# Altium project Gyro_Single_Axis.PrjPcb (part 1 of 2)
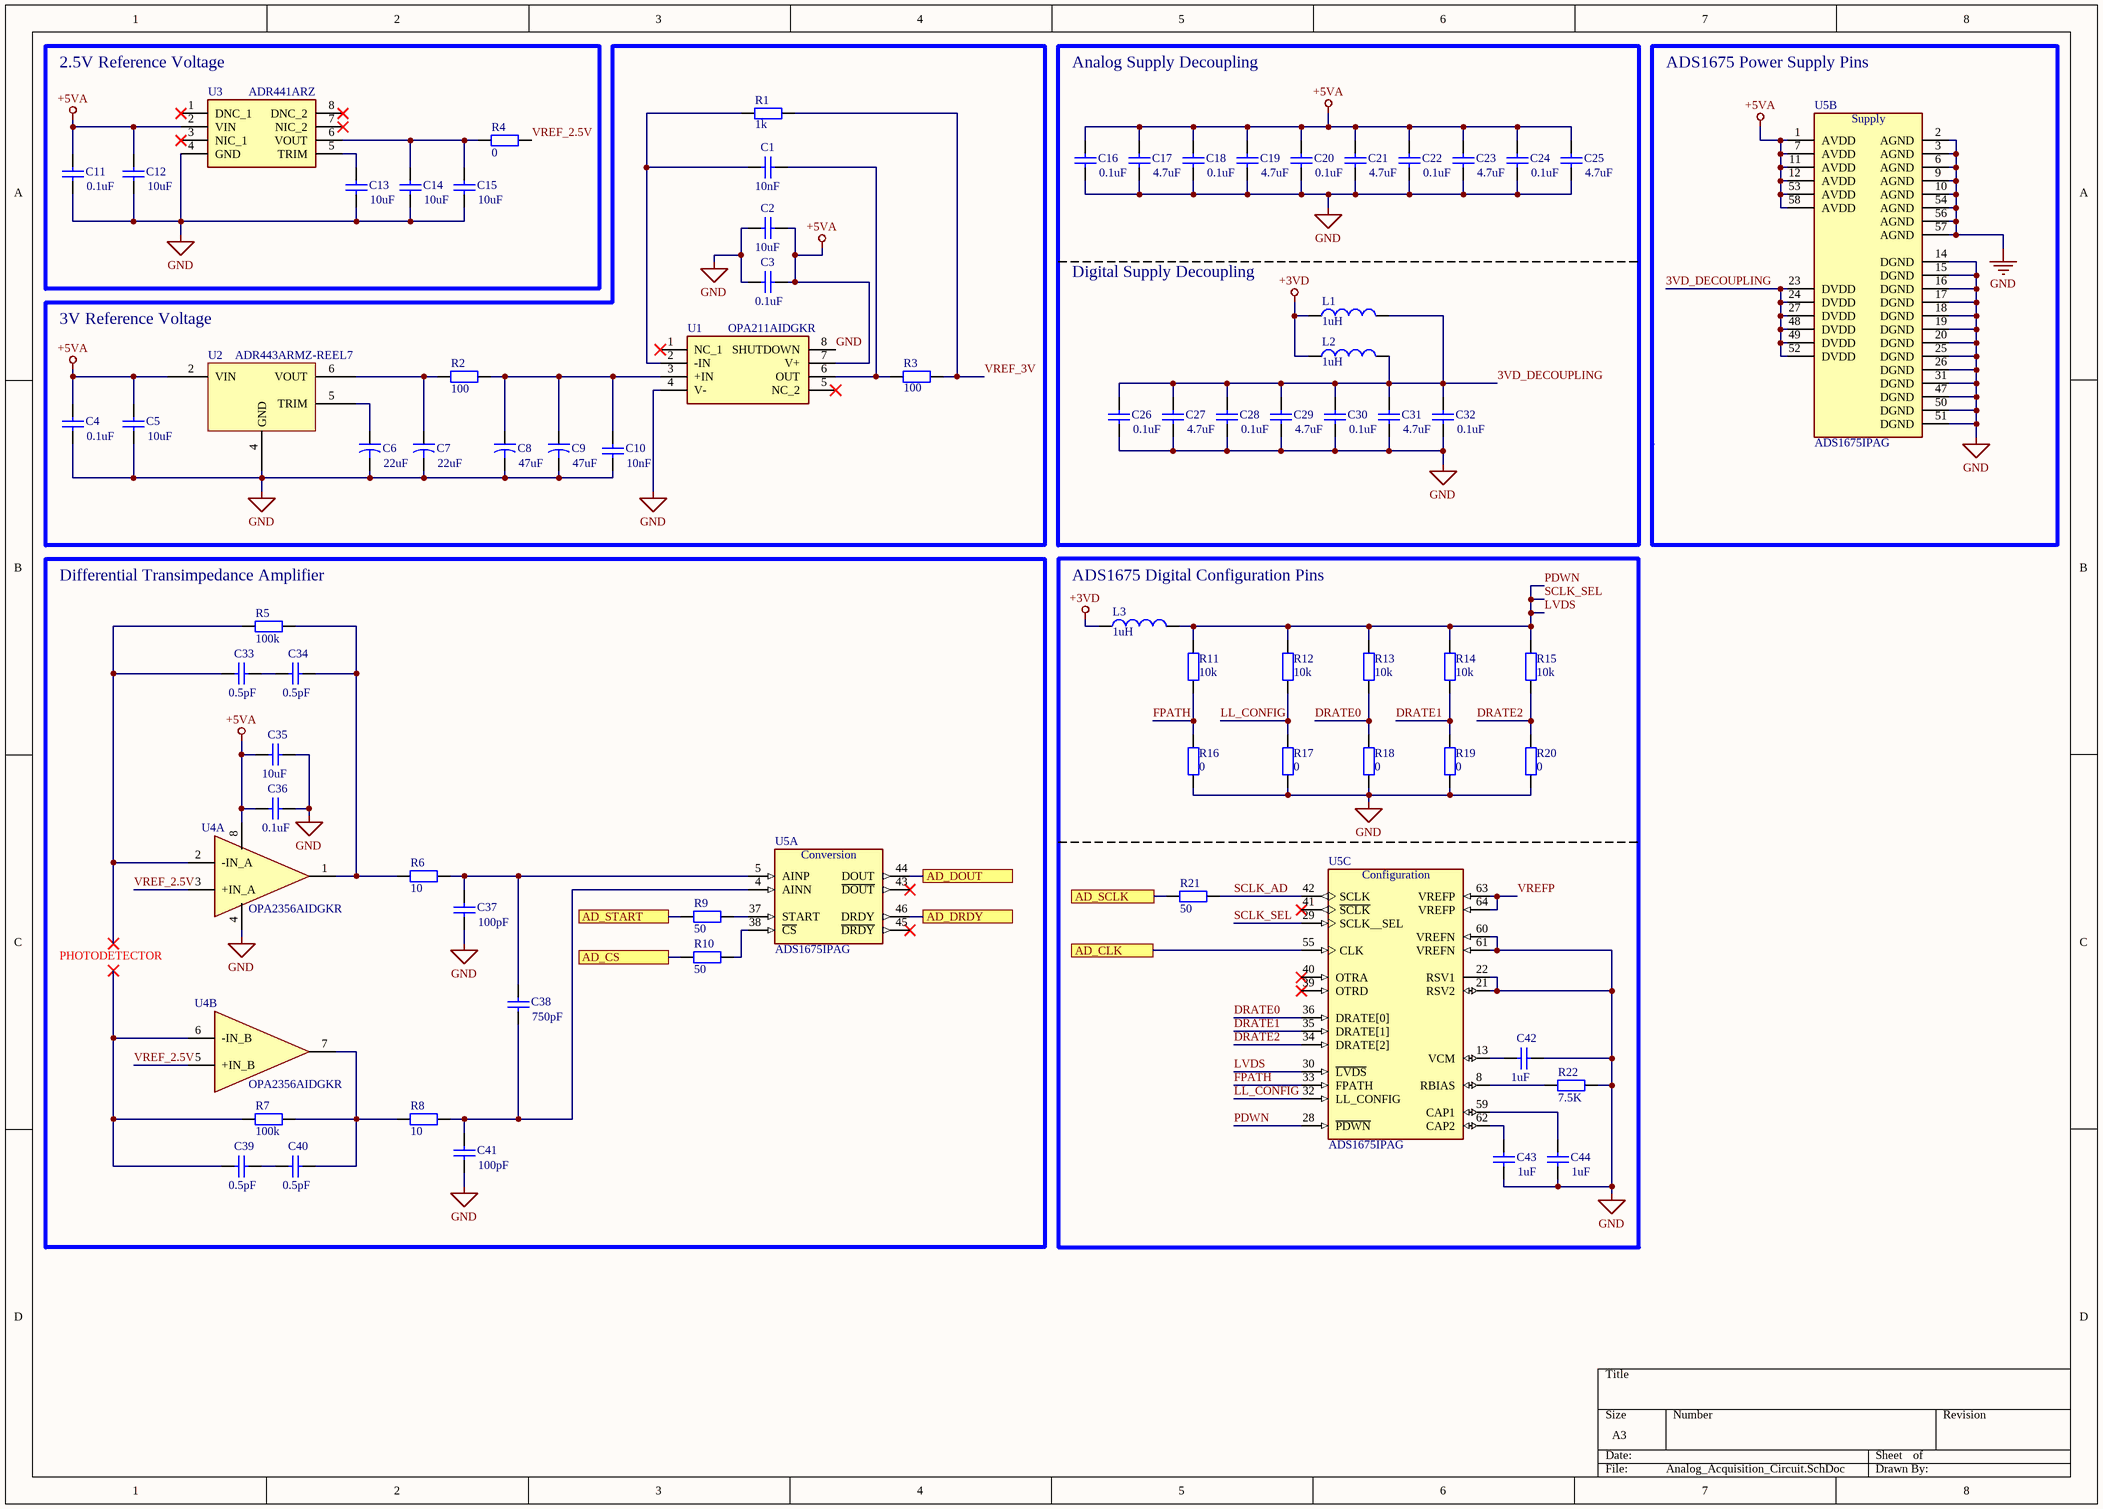
[diagram p0: Analog_Acquisition_Circuit.SchDoc]
4 sheets, 254 parts. Net scope: flat (ports and power ports of the same name join across sheets).
Board file: Acquisition_Board.PcbDoc
Sheets:
  Analog_Acquisition_Circuit.SchDoc
  Analog_Modulation_and_Supply.SchDoc
  Digital_STMG447RET6.SchDoc
  Digital_Supply_and_Connectors.SchDoc

## Sheet Analog_Acquisition_Circuit.SchDoc
size A3; SheetNumber: 1; SheetTotal: 4

### Parts
C1  value 10nF  [RAD-0.3]  (hidden comment: Cap)
C2  value 10uF  [RAD-0.3]  (hidden comment: Cap)
C3  value 0.1uF  [RAD-0.3]  (hidden comment: Cap)
C4  value 0.1uF  [RAD-0.3]  (hidden comment: Cap)
C5  value 10uF  [RAD-0.3]  (hidden comment: Cap)
C6  value 22uF  [CAPR5-4X5]  (hidden comment: Cap2)
C7  value 22uF  [CAPR5-4X5]  (hidden comment: Cap2)
C8  value 47uF  [CAPR5-4X5]  (hidden comment: Cap2)
C9  value 47uF  [CAPR5-4X5]  (hidden comment: Cap2)
C10  value 10nF  [RAD-0.3]  (hidden comment: Cap)
C11  value 0.1uF  [RAD-0.3]  (hidden comment: Cap)
C12  value 10uF  [RAD-0.3]  (hidden comment: Cap)
C13  value 10uF  [RAD-0.3]  (hidden comment: Cap)
C14  value 10uF  [RAD-0.3]  (hidden comment: Cap)
C15  value 10uF  [RAD-0.3]  (hidden comment: Cap)
C16  value 0.1uF  [RAD-0.3]  (hidden comment: Cap)
C17  value 4.7uF  [RAD-0.3]  (hidden comment: Cap)
C18  value 0.1uF  [RAD-0.3]  (hidden comment: Cap)
C19  value 4.7uF  [RAD-0.3]  (hidden comment: Cap)
C20  value 0.1uF  [RAD-0.3]  (hidden comment: Cap)
C21  value 4.7uF  [RAD-0.3]  (hidden comment: Cap)
C22  value 0.1uF  [RAD-0.3]  (hidden comment: Cap)
C23  value 4.7uF  [RAD-0.3]  (hidden comment: Cap)
C24  value 0.1uF  [RAD-0.3]  (hidden comment: Cap)
C25  value 4.7uF  [RAD-0.3]  (hidden comment: Cap)
C26  value 0.1uF  [RAD-0.3]  (hidden comment: Cap)
C27  value 4.7uF  [RAD-0.3]  (hidden comment: Cap)
C28  value 0.1uF  [RAD-0.3]  (hidden comment: Cap)
C29  value 4.7uF  [RAD-0.3]  (hidden comment: Cap)
C30  value 0.1uF  [RAD-0.3]  (hidden comment: Cap)
C31  value 4.7uF  [RAD-0.3]  (hidden comment: Cap)
C32  value 0.1uF  [RAD-0.3]  (hidden comment: Cap)
C33  value 0.5pF  [RAD-0.3]  (hidden comment: Cap)
C34  value 0.5pF  [RAD-0.3]  (hidden comment: Cap)
C35  value 10uF  [RAD-0.3]  (hidden comment: Cap)
C36  value 0.1uF  [RAD-0.3]  (hidden comment: Cap)
C37  value 100pF  [RAD-0.3]  (hidden comment: Cap)
C38  value 750pF  [RAD-0.3]  (hidden comment: Cap)
C39  value 0.5pF  [RAD-0.3]  (hidden comment: Cap)
C40  value 0.5pF  [RAD-0.3]  (hidden comment: Cap)
C41  value 100pF  [RAD-0.3]  (hidden comment: Cap)
C42  value 1uF  [RAD-0.3]  (hidden comment: Cap)
C43  value 1uF  [RAD-0.3]  (hidden comment: Cap)
C44  value 1uF  [RAD-0.3]  (hidden comment: Cap)
L1  value 1uH  [0402-A]  (hidden comment: Inductor)
L2  value 1uH  [0402-A]  (hidden comment: Inductor)
L3  value 1uH  [0402-A]  (hidden comment: Inductor)
R1  value 1k  [AXIAL-0.4]  (hidden comment: Res2)
R2  value 100  [AXIAL-0.4]  (hidden comment: Res2)
R3  value 100  [AXIAL-0.4]  (hidden comment: Res2)
R4  value 0  [AXIAL-0.4]  (hidden comment: Res2)
R5  value 100k  [AXIAL-0.4]  (hidden comment: Res2)
R6  value 10  [AXIAL-0.4]  (hidden comment: Res2)
R7  value 100k  [AXIAL-0.4]  (hidden comment: Res2)
R8  value 10  [AXIAL-0.4]  (hidden comment: Res2)
R9  value 50  [AXIAL-0.4]  (hidden comment: Res2)
R10  value 50  [AXIAL-0.4]  (hidden comment: Res2)
R11  value 10k  [AXIAL-0.4]  (hidden comment: Res2)
R12  value 10k  [AXIAL-0.4]  (hidden comment: Res2)
R13  value 10k  [AXIAL-0.4]  (hidden comment: Res2)
R14  value 10k  [AXIAL-0.4]  (hidden comment: Res2)
R15  value 10k  [AXIAL-0.4]  (hidden comment: Res2)
R16  value 0  [AXIAL-0.4]  (hidden comment: Res2)
R17  value 0  [AXIAL-0.4]  (hidden comment: Res2)
R18  value 0  [AXIAL-0.4]  (hidden comment: Res2)
R19  value 0  [AXIAL-0.4]  (hidden comment: Res2)
R20  value 0  [AXIAL-0.4]  (hidden comment: Res2)
R21  value 50  [AXIAL-0.4]  (hidden comment: Res2)
R22  value 7.5K  [AXIAL-0.4]  (hidden comment: Res2)
U1  OPA211AIDGKR  [SOP65P490X110-8N]
U2  ADR443ARMZ-REEL7  [ADR443ARMZ-REEL7 - duplicate]
U3  ADR441ARZ  [ADR441ARZ]
U4  OPA2356AIDGKR  [OPA2356AIDGKR]  (parts A,B of 2)
U5  ADS1675IPAG  [ADS1675IPAG]  (parts A,B,C of 3)

### Blocks framed on the sheet
2.5V Reference Voltage: C11-C15 R4 U3
3V Reference Voltage: C1-C10 R1-R3 U1 U2
ADS1675 Power Supply Pins: U5
Differential Transimpedance Amplifier: C33-C41 R5-R10 U4 U5
ADS1675 Digital Configuration Pins: C42-C44 L3 R11-R22 U5

### Ports
AD_CLK (see Digital_STMG447RET6[5B], Digital_Supply_and_Connectors[2A], Digital_Supply_and_Connectors[4A], Digital_Supply_and_Connectors[7B]), AD_CS (see Digital_STMG447RET6[2B], Digital_Supply_and_Connectors[1A], Digital_Supply_and_Connectors[4A]), AD_DOUT (see Digital_STMG447RET6[5B], Digital_Supply_and_Connectors[1A]), AD_DRDY (see Digital_STMG447RET6[2B], Digital_Supply_and_Connectors[1A]), AD_SCLK (see Digital_STMG447RET6[5B], Digital_Supply_and_Connectors[1A], Digital_Supply_and_Connectors[4A]), AD_START (see Digital_STMG447RET6[3B], Digital_Supply_and_Connectors[1A], Digital_Supply_and_Connectors[4A])

### Nets
+3VD: L1.1 L2.1 L3.1
GND: C2.1 C2.2 C3.1 C3.2 C4.1 C4.2 C5.1 C5.2 C6.2 C7.2 C8.2 C9.2 C10.1 C11.1 C11.2 C12.1 C12.2 C13.1 C14.1 C15.1 C16.1 C16.2 C17.1 C17.2 C18.1 C18.2 C19.1 C19.2 C20.1 C20.2 C21.1 C21.2 C22.1 C22.2 C23.1 C23.2 C24.1 C24.2 C25.1 C25.2 C26.1 C27.1 C28.1 C29.1 C30.1 C31.1 C32.1 C35.1 C35.2 C36.1 C36.2 C37.1 C41.1 C42.1 C43.2 C44.2 R16.1 R17.1 R18.1 R19.1 R20.1 R22.2 U1.4(V-) U1.7(V+) U1.8(SHUTDOWN) U2.2(VIN) U2.4(GND) U3.2(VIN) U3.4(GND) U4.4(V-) U4.8(V+) U5.1(AVDD) U5.2(AGND) U5.3(AGND) U5.6(AGND) U5.7(AVDD) U5.9(AGND) U5.10(AGND) U5.11(AVDD) U5.12(AVDD) U5.14(DGND) U5.15(DGND) U5.16(DGND) U5.17(DGND) U5.18(DGND) U5.19(DGND) U5.20(DGND) U5.21(RSV2) U5.22(RSV1) U5.25(DGND) U5.26(DGND) U5.31(DGND) U5.47(DGND) U5.50(DGND) U5.51(DGND) U5.53(AVDD) U5.54(AGND) U5.56(AGND) U5.57(AGND) U5.58(AVDD) U5.60(VREFN) U5.61(VREFN)  [also labelled +5VA]
3VD_DECOUPLING: C26.2 C27.2 C28.2 C29.2 C30.2 C31.2 C32.2 L1.2 L2.2 U5.23(DVDD) U5.24(DVDD) U5.27(DVDD) U5.48(DVDD) U5.49(DVDD) U5.52(DVDD)
DRATE0: R13.1 R18.2 U5.36(DRATE[0])
DRATE1: R14.1 R19.2 U5.35(DRATE[1])
DRATE2: R15.1 R20.2 U5.34(DRATE[2])
FPATH: R11.1 R16.2 U5.33(FPATH)
LL_CONFIG: R12.1 R17.2 U5.32(LL_CONFIG)
LVDS: L3.2 R11.2 R12.2 R13.2 R14.2 R15.2 U5.28(~{PDWN}) U5.29(SCLK__SEL) U5.30(~{LVDS})  [also labelled PDWN, SCLK_SEL]
SCLK_AD: R21.2 U5.42(SCLK)
VREF_2.5V: R4.2 U4.3(+IN_A) U4.5(+IN_B)
VREF_3V: R1.1 R3.1
VREFP: U5.63(VREFP) U5.64(VREFP)
NetC1_1: C1.1 R3.2 U1.6(OUT)
NetC1_2: C1.2 R1.2 U1.2(-IN)
NetC6_1: C6.1 U2.5(TRIM)
NetC7_1: C7.1 R2.1 U2.6(VOUT)
NetC8_1: C8.1 C9.1 C10.2 R2.2 U1.3(+IN)
NetC13_2: C13.2 U3.5(TRIM)
NetC14_2: C14.2 C15.2 R4.1 U3.6(VOUT)
NetC33_1: C33.1 C34.2
NetC33_2: C33.2 R5.1 U4.2(-IN_A)
NetC34_1: C34.1 R5.2 R6.1 U4.1(OUT_A)
NetC37_2: C37.2 C38.2 R6.2 U5.5(AINP)
NetC38_1: C38.1 C41.2 R8.2 U5.4(AINN)
NetC39_1: C39.1 C40.2
NetC39_2: C39.2 R7.1 U4.6(-IN_B)
NetC40_1: C40.1 R7.2 R8.1 U4.7(OUT_B)
NetC42_2: C42.2 U5.13(VCM)
NetC43_1: C43.1 U5.62(CAP2)
NetC44_1: C44.1 U5.59(CAP1)
NetJ4_56: R9.1 ; port AD_START
NetJ4_58: R10.1 ; port AD_CS
NetJ4_60: R21.1 ; port AD_SCLK
NetJ4_62: U5.44(DOUT) ; port AD_DOUT
NetJ4_63: U5.55(CLK) ; port AD_CLK
NetJ4_64: U5.46(DRDY) ; port AD_DRDY
NetR9_2: R9.2 U5.37(START)
NetR10_2: R10.2 U5.38(~{CS})
NetR22_1: R22.1 U5.8(RBIAS)

Not connected (* = marked no-connect by the designer): U1 1(NC_1)* 5(NC_2)*; U3 1(DNC_1)* 3(NIC_1)* 7(NIC_2)* 8(DNC_2)*; U5 39(OTRD)* 40(OTRA)* 41(~{S}~{C}~{L}~{K})* 43(~{DOUT})* 45(~{DRDY})*

### Notes on the sheet
- Analog Supply Decoupling
- (near L1) Digital Supply Decoupling
- PHOTODETECTOR
- (in symbol ADS1675IPAG, part A) Conversion
- (in symbol ADS1675IPAG, part B) Supply
- (in symbol ADS1675IPAG, part C) Configuration

### Library data of the parts
C1-C5 C10-C44 = Cap: Capacitor; Published: 8-Jun-2000; LatestRevisionDate: 17-Jul-2002; LatestRevisionNote: Re-released for DXP Platform.; PackageReference: RAD-0.3; Publisher: Altium Limited; PackageDescription: Radial Cap, Thru-Hole; 2 Leads; 0.3 in Pin Spacing
C6-C9 = Cap2: Capacitor; Published: 23-Sep-2002; PackageReference: CAPR5-4X5; Publisher: Altium Limited; PackageDescription: Capacitor; 2 Leads
L1-L3 = Inductor: Code_IEC: 1005; Published: 8-Jun-2000; LatestRevisionDate: 29-May-2009; LatestRevisionNote: IPC-7351 Footprint Added.; PackageReference: 0402-A; Publisher: Altium Limited; PackageDescription: Chip Inductor; Code_JEITA: 0402
R1-R22 = Res2: Resistor; Published: 8-Jun-2000; LatestRevisionDate: 17-Jul-2002; LatestRevisionNote: Re-released for DXP Platform.; PackageReference: AXIAL-0.4; Publisher: Altium Limited; PackageDescription: Axial Device, Thru-Hole; 2 Leads; 0.4 in Pin Spacing
U1 = OPA211AIDGKR: Precision Amplifiers 1.1nV/rtHz Noise Lo Pwr Prec Op Amp; Manufacturer_Name: Texas Instruments; Geometry.Height: 1.1mm; Manufacturer_Part_Number: OPA211AIDGKR; Mouser Part Number: 595-OPA211AIDGKR; Mouser Price/Stock: https://www.mouser.co.uk/ProductDetail/Texas-Instruments/OPA211AIDGKR?qs=iSMark9AYDXgBzgxm95hVg%3D%3D; Arrow Part Number: OPA211AIDGKR; Arrow Price/Stock: https://www.arrow.com/en/products/opa211aidgkr/texas-instruments?utm_currency=USD&region=nac; Datasheet Link: https://www.ti.com/general/docs/suppproductinfo.tsp?distId=10&gotoUrl=https%3A%2F%2Fwww.ti.com%2Flit%2Fgpn%2Fopa211
U2 = ADR443ARMZ-REEL7: Ultralow Noise, LDO XFET Voltage Reference with Current Sink and Source, 3 V Output, 3.5 to 18 V Supply, Industrial, 8-pin SOP (RM-8), Reel
U3 = ADR441ARZ: Series Voltage Reference IC Fixed 2.5V V +/-0.12% 10 mA 8-SOIC; Manufacturer_Name: Analog Devices; Geometry.Height: 1.75mm; Manufacturer_Part_Number: ADR441ARZ; Mouser Part Number: 584-ADR441ARZ; Mouser Price/Stock: https://www.mouser.co.uk/ProductDetail/Analog-Devices/ADR441ARZ?qs=WIvQP4zGanjF%252B9HT%2FrItQQ%3D%3D; Arrow Part Number: ADR441ARZ; Arrow Price/Stock: https://www.arrow.com/en/products/adr441arz/analog-devices?region=europe; Datasheet Link: https://www.analog.com/media/en/technical-documentation/data-sheets/adr440_441_443_444_445.pdf
U4 = OPA2356AIDGKR: High Speed Operational Amplifiers 2.5V 200MHz GBW CMOS Dual Op Amp; Manufacturer_Name: Texas Instruments; Geometry.Height: 1.1mm; Manufacturer_Part_Number: OPA2356AIDGKR; Mouser Part Number: 595-OPA2356AIDGKR; Mouser Price/Stock: https://www.mouser.co.uk/ProductDetail/Texas-Instruments/OPA2356AIDGKR?qs=7nS3%252BbEUL6thmoW05USD8Q%3D%3D; Arrow Part Number: OPA2356AIDGKR; Arrow Price/Stock: https://www.arrow.com/en/products/opa2356aidgkr/texas-instruments?region=nac; Datasheet Link: http://www.ti.com/lit/ds/symlink/opa2356.pdf
U5 = ADS1675IPAG: 4MSPS, 24-Bit Analog-to-Digital Converter; MF: Texas Instruments; SnapEDA_Link: https://www.snapeda.com/parts/ADS1675IPAG/Texas+Instruments/view-part/?ref=snap; Package: TQFP-64 Texas Instruments; MP: ADS1675IPAG; Check_prices: https://www.snapeda.com/parts/ADS1675IPAG/Texas+Instruments/view-part/?ref=eda; Purchase-URL: https://pricing.snapeda.com/search/part/ADS1675IPAG/?ref=eda; Price: None; Value: *; Availability: In Stock

## Sheet Analog_Modulation_and_Supply.SchDoc
size A3; SheetNumber: 2; SheetTotal: 3
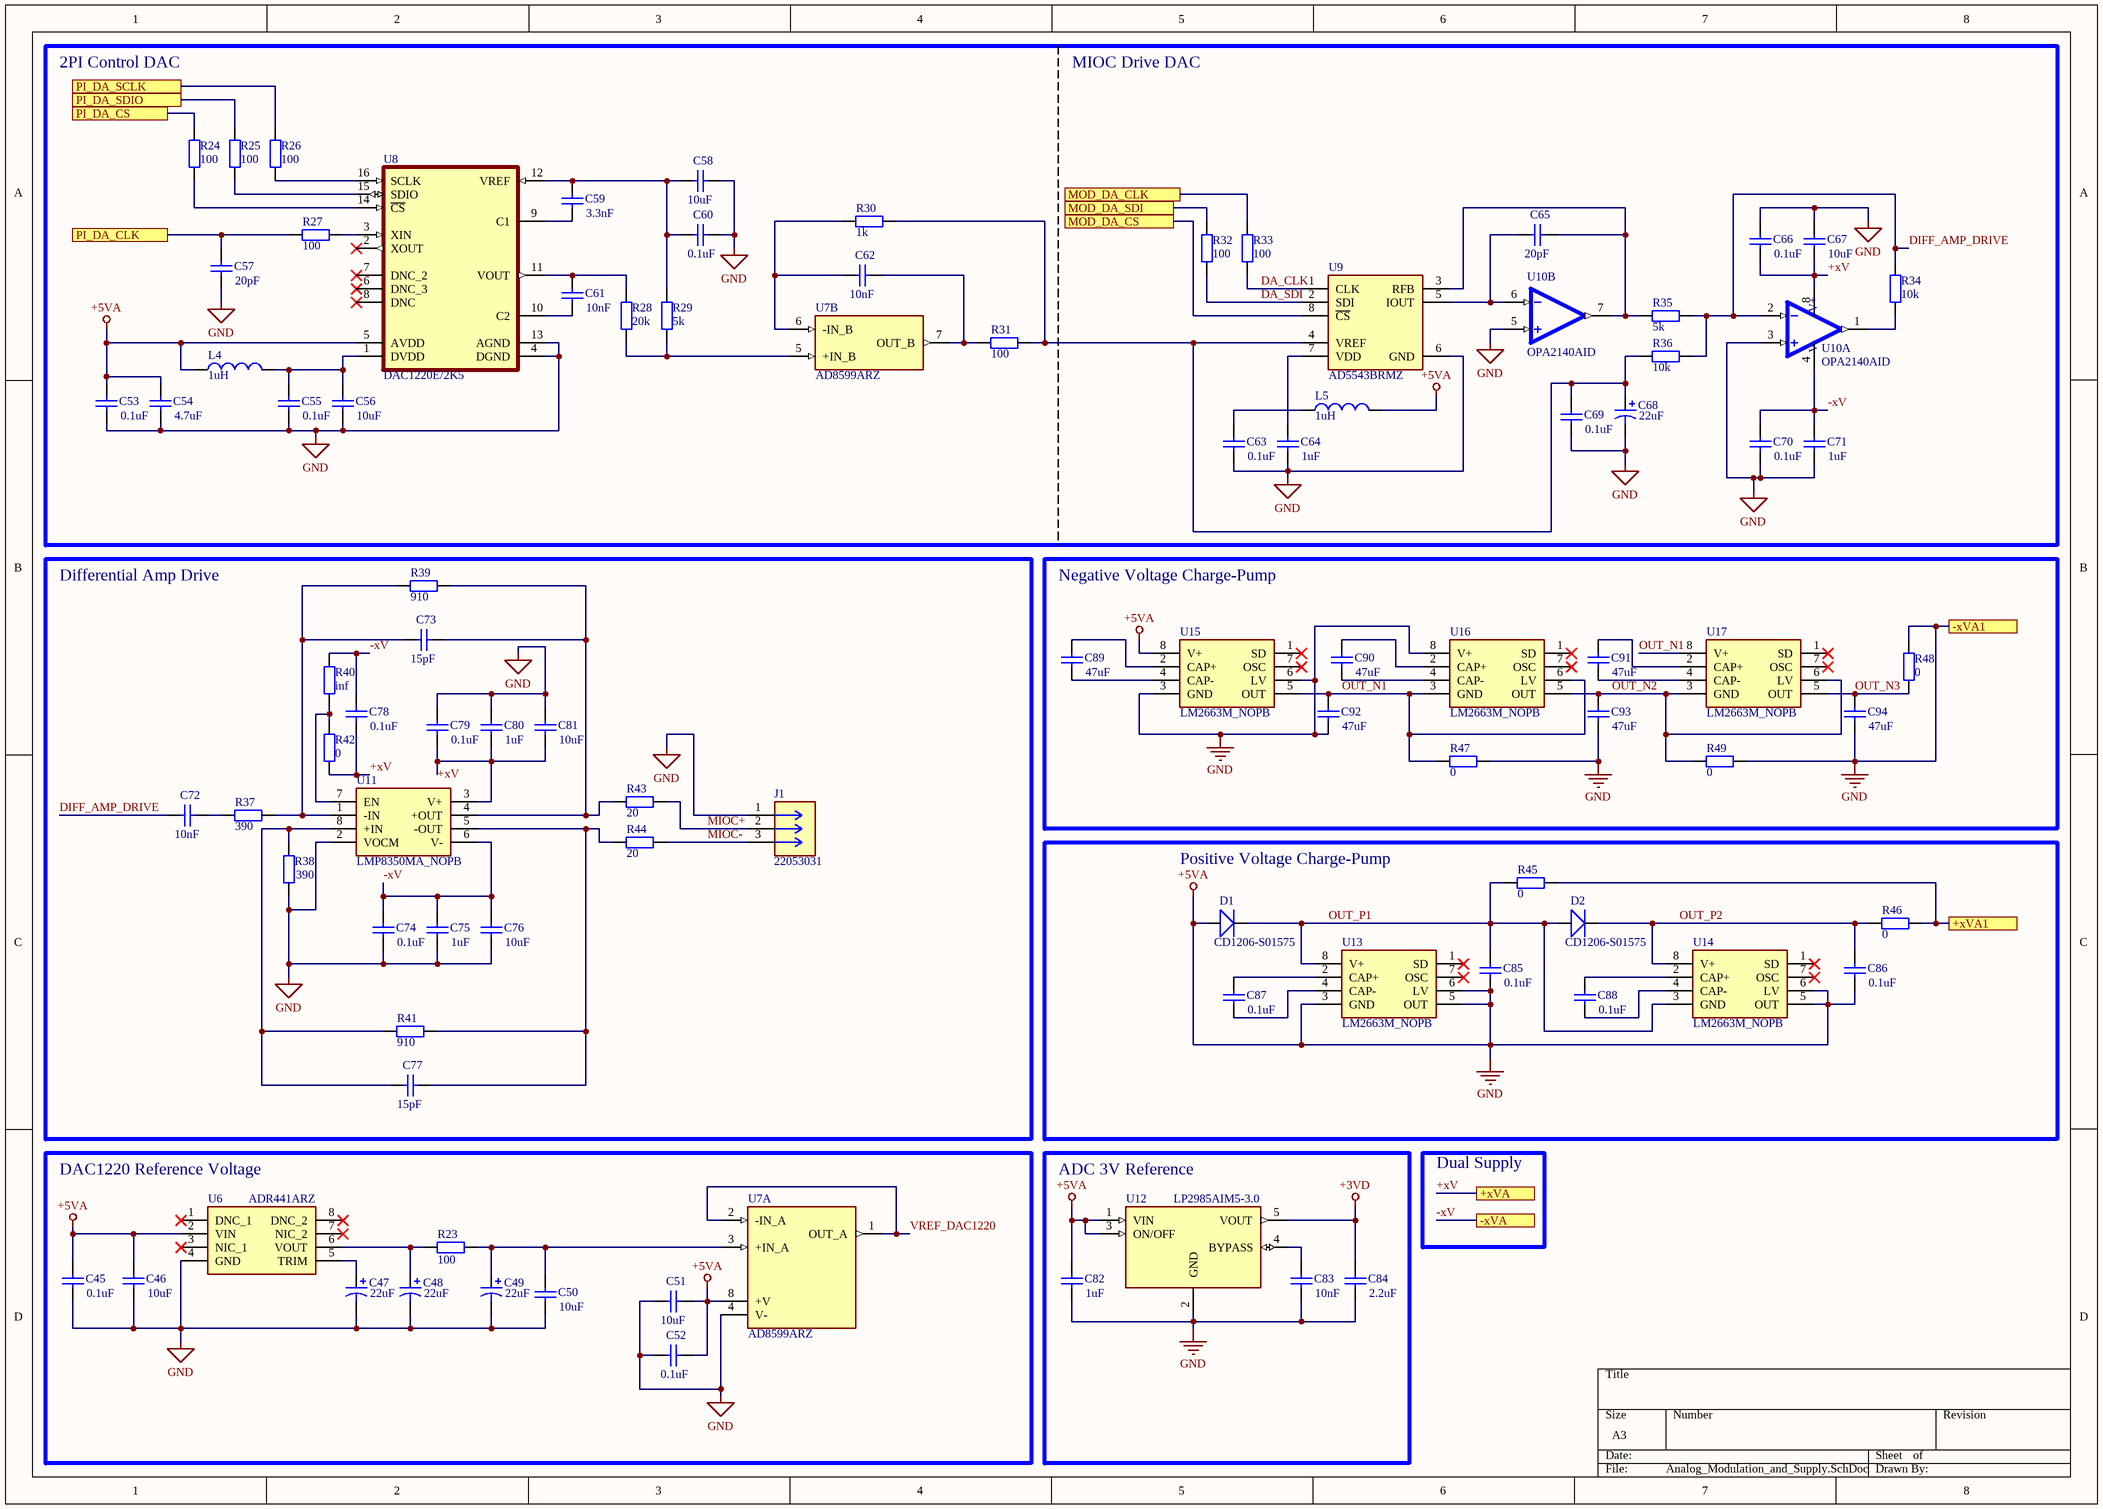
[diagram p1: Analog_Modulation_and_Supply.SchDoc]

### Parts
C45  value 0.1uF  [RAD-0.3]  (hidden comment: Cap)
C46  value 10uF  [RAD-0.3]  (hidden comment: Cap)
C47  value 22uF  [RB7.6-15]  (hidden comment: Cap Pol1)
C48  value 22uF  [RB7.6-15]  (hidden comment: Cap Pol1)
C49  value 22uF  [RB7.6-15]  (hidden comment: Cap Pol1)
C50  value 10uF  [RAD-0.3]  (hidden comment: Cap)
C51  value 10uF  [RAD-0.3]  (hidden comment: Cap)
C52  value 0.1uF  [RAD-0.3]  (hidden comment: Cap)
C53  value 0.1uF  [RAD-0.3]  (hidden comment: Cap)
C54  value 4.7uF  [RAD-0.3]  (hidden comment: Cap)
C55  value 0.1uF  [RAD-0.3]  (hidden comment: Cap)
C56  value 10uF  [RAD-0.3]  (hidden comment: Cap)
C57  value 20pF  [RAD-0.3]  (hidden comment: Cap)
C58  value 10uF  [RAD-0.3]  (hidden comment: Cap)
C59  value 3.3nF  [RAD-0.3]  (hidden comment: Cap)
C60  value 0.1uF  [RAD-0.3]  (hidden comment: Cap)
C61  value 10nF  [RAD-0.3]  (hidden comment: Cap)
C62  value 10nF  [RAD-0.3]  (hidden comment: Cap)
C63  value 0.1uF  [RAD-0.3]  (hidden comment: Cap)
C64  value 1uF  [RAD-0.3]  (hidden comment: Cap)
C65  value 20pF  [RAD-0.3]  (hidden comment: Cap)
C66  value 0.1uF  [RAD-0.3]  (hidden comment: Cap)
C67  value 10uF  [RAD-0.3]  (hidden comment: Cap)
C68  value 22uF  [RB7.6-15]  (hidden comment: Cap Pol1)
C69  value 0.1uF  [RAD-0.3]  (hidden comment: Cap)
C70  value 0.1uF  [RAD-0.3]  (hidden comment: Cap)
C71  value 1uF  [RAD-0.3]  (hidden comment: Cap)
C72  value 10nF  [RAD-0.3]  (hidden comment: Cap)
C73  value 15pF  [RAD-0.3]  (hidden comment: Cap)
C74  value 0.1uF  [RAD-0.3]  (hidden comment: Cap)
C75  value 1uF  [RAD-0.3]  (hidden comment: Cap)
C76  value 10uF  [RAD-0.3]  (hidden comment: Cap)
C77  value 15pF  [RAD-0.3]  (hidden comment: Cap)
C78  value 0.1uF  [RAD-0.3]  (hidden comment: Cap)
C79  value 0.1uF  [RAD-0.3]  (hidden comment: Cap)
C80  value 1uF  [RAD-0.3]  (hidden comment: Cap)
C81  value 10uF  [RAD-0.3]  (hidden comment: Cap)
C82  value 1uF  [RAD-0.3]  (hidden comment: Cap)
C83  value 10nF  [RAD-0.3]  (hidden comment: Cap)
C84  value 2.2uF  [RAD-0.3]  (hidden comment: Cap)
C85  value 0.1uF  [RAD-0.3]  (hidden comment: Cap)
C86  value 0.1uF  [RAD-0.3]  (hidden comment: Cap)
C87  value 0.1uF  [RAD-0.3]  (hidden comment: Cap)
C88  value 0.1uF  [RAD-0.3]  (hidden comment: Cap)
C89  value 47uF  [RAD-0.3]  (hidden comment: Cap)
C90  value 47uF  [RAD-0.3]  (hidden comment: Cap)
C91  value 47uF  [RAD-0.3]  (hidden comment: Cap)
C92  value 47uF  [RAD-0.3]  (hidden comment: Cap)
C93  value 47uF  [RAD-0.3]  (hidden comment: Cap)
C94  value 47uF  [RAD-0.3]  (hidden comment: Cap)
D1  CD1206-S01575  [LED-1206]
D2  CD1206-S01575  [LED-1206]
J1  22053031  [22-05-3031]
L4  value 1uH  [0402-A]  (hidden comment: Inductor)
L5  value 1uH  [0402-A]  (hidden comment: Inductor)
R23  value 100  [AXIAL-0.4]  (hidden comment: Res2)
R24  value 100  [AXIAL-0.4]  (hidden comment: Res2)
R25  value 100  [AXIAL-0.4]  (hidden comment: Res2)
R26  value 100  [AXIAL-0.4]  (hidden comment: Res2)
R27  value 100  [AXIAL-0.4]  (hidden comment: Res2)
R28  value 20k  [AXIAL-0.4]  (hidden comment: Res2)
R29  value 5k  [AXIAL-0.4]  (hidden comment: Res2)
R30  value 1k  [AXIAL-0.4]  (hidden comment: Res2)
R31  value 100  [AXIAL-0.4]  (hidden comment: Res2)
R32  value 100  [AXIAL-0.4]  (hidden comment: Res2)
R33  value 100  [AXIAL-0.4]  (hidden comment: Res2)
R34  value 10k  [AXIAL-0.4]  (hidden comment: Res2)
R35  value 5k  [AXIAL-0.4]  (hidden comment: Res2)
R36  value 10k  [AXIAL-0.4]  (hidden comment: Res2)
R37  value 390  [AXIAL-0.4]  (hidden comment: Res2)
R38  value 390  [AXIAL-0.4]  (hidden comment: Res2)
R39  value 910  [AXIAL-0.4]  (hidden comment: Res2)
R40  value inf  [AXIAL-0.4]  (hidden comment: Res2)
R41  value 910  [AXIAL-0.4]  (hidden comment: Res2)
R42  value 0  [AXIAL-0.4]  (hidden comment: Res2)
R43  value 20  [AXIAL-0.4]  (hidden comment: Res2)
R44  value 20  [AXIAL-0.4]  (hidden comment: Res2)
R45  value 0  [AXIAL-0.4]  (hidden comment: Res2)
R46  value 0  [AXIAL-0.4]  (hidden comment: Res2)
R47  value 0  [AXIAL-0.4]  (hidden comment: Res2)
R48  value 0  [AXIAL-0.4]  (hidden comment: Res2)
R49  value 0  [AXIAL-0.4]  (hidden comment: Res2)
U6  ADR441ARZ  [SOIC127P600X175-8N]
U7  AD8599ARZ  [AD8599ARZ]  (parts A,B of 2)
U8  DAC1220E/2K5  [DAC1220E/2K5]
U9  AD5543BRMZ  [SOP65P490X110-8N]
U10  OPA2140AID  [OPA2140AID]  (parts A,B of 2)
U11  LMP8350MA_NOPB  [LMP8350MA_NOPB]
U12  LP2985AIM5-3.0  [LP2985AIM5-3.0]
U13  LM2663M_NOPB  [LM2663M_NOPB]
U14  LM2663M_NOPB  [LM2663M_NOPB]
U15  LM2663M_NOPB  [LM2663M_NOPB]
U16  LM2663M_NOPB  [LM2663M_NOPB]
U17  LM2663M_NOPB  [LM2663M_NOPB]

### Blocks framed on the sheet
Differential Amp Drive: C72-C81 J1 R37-R44 U11
Negative Voltage Charge-Pump: C89-C94 R47-R49 U15-U17
Positive Voltage Charge-Pump: C85-C88 D1 D2 R45 R46 U13 U14
DAC1220 Reference Voltage: C45-C52 R23 U6 U7
ADC 3V Reference: C82-C84 U12

### Ports
+xVA, +xVA1 (see Digital_Supply_and_Connectors[6A]), -xVA, -xVA1 (see Digital_Supply_and_Connectors[6A]), MOD_DA_CLK (see Digital_Supply_and_Connectors[2B]), MOD_DA_CS (see Digital_Supply_and_Connectors[2B]), MOD_DA_SDI (see Digital_Supply_and_Connectors[2B]), PI_DA_CLK (see Digital_Supply_and_Connectors[2B]), PI_DA_CS (see Digital_Supply_and_Connectors[2B]), PI_DA_SCLK (see Digital_Supply_and_Connectors[3B]), PI_DA_SDIO (see Digital_Supply_and_Connectors[3B])

### Nets
+3VD: C84.1 U12.5(VOUT)
+xVA: R45.1 R46.1 ; port +xVA1
GND: C45.1 C45.2 C46.1 C46.2 C47.2 C48.2 C49.2 C50.1 C51.1 C51.2 C52.1 C52.2 C53.1 C53.2 C54.1 C54.2 C55.2 C56.2 C57.2 C58.1 C60.1 C63.2 C64.2 C66.1 C67.1 C68.2 C69.1 C70.2 C71.2 C74.2 C75.2 C76.2 C79.1 C80.1 C81.1 C82.1 C82.2 C83.2 C84.2 C85.2 C86.2 C92.2 C93.2 C94.2 D1.POS J1.1 L4.1 L5.2 R38.2 R47.1 R48.1 R49.1 U6.2(VIN) U6.4(GND) U7.4(V-) U7.8(+V) U8.4(DGND) U8.5(AVDD) U8.13(AGND) U9.6(GND) U10.3(+INA) U10.5(+INB) U11.2(VOCM) U12.1(VIN) U12.2(GND) U12.3(ON/OFF) U13.3(GND) U13.5(OUT) U13.6(LV) U14.5(OUT) U14.6(LV) U15.3(GND) U15.6(LV) U15.8(V+) U16.8(V+) ; port -xVA1  [also labelled +5VA]
+xV: C66.2 C67.2 C78.2 R42.2 U10.8(V+) ; port +xVA
-xV: C70.1 C71.1 C74.1 C75.1 C76.1 C78.1 R40.1 U10.4(V-) U11.6(V-) ; port -xVA
DA_CLK: R33.2 U9.1(CLK)
DA_SDI: R32.2 U9.2(SDI)
DIFF_AMP_DRIVE: C72.2 R34.1 R35.1 R36.1 U10.2(-INA)
MIOC+: J1.2 R43.1
MIOC-: J1.3 R44.1
OUT_N1: C92.1 R47.2 U15.5(OUT) U16.3(GND) U16.6(LV) U17.8(V+)
OUT_N2: C93.1 R49.2 U16.5(OUT) U17.3(GND) U17.6(LV)
OUT_N3: C94.1 R48.2 U17.5(OUT)
OUT_P1: C85.1 D1.NEG D2.POS R45.2 U13.8(V+) U14.3(GND)
OUT_P2: C86.1 D2.NEG R46.2 U14.8(V+)
VREF_DAC1220: U7.1(OUT_A) U7.2(-IN_A)
NetC47_1: C47.1 U6.5(TRIM)
NetC48_1: C48.1 R23.1 U6.6(VOUT)
NetC49_1: C49.1 C50.2 R23.2 U7.3(+IN_A)
NetC55_1: C55.1 C56.1 L4.2 U8.1(DVDD)
NetC57_1: C57.1 R27.2 ; port PI_DA_CLK
NetC58_2: C58.2 C59.1 C60.2 R29.2 U8.12(VREF)
NetC59_2: C59.2 U8.9(C1)
NetC61_1: C61.1 R28.2 U8.11(VOUT)
NetC61_2: C61.2 U8.10(C2)
NetC62_1: C62.1 R31.2 U7.7(OUT_B)
NetC62_2: C62.2 R30.2 U7.6(-IN_B)
NetC63_1: C63.1 L5.1
NetC64_1: C64.1 U9.7(VDD)
NetC65_1: C65.1 R35.2 U9.3(RFB) U10.7(OUTB)
NetC65_2: C65.2 U9.5(IOUT) U10.6(-INB)
NetC68_1: C68.1 C69.2 R30.1 R31.1 R36.2 U9.4(VREF)
NetC72_1: C72.1 R37.2
NetC73_1: C73.1 R39.1 R43.2 U11.4(+OUT)
NetC73_2: C73.2 R37.1 R39.2 U11.1(-IN)
NetC77_1: C77.1 R41.1 R44.2 U11.5(-OUT)
NetC77_2: C77.2 R38.1 R41.2 U11.8(+IN)
NetC79_2: C79.2 C80.2 C81.2 U11.3(V+)
NetC83_1: C83.1 U12.4(BYPASS)
NetC87_1: C87.1 U13.2(CAP+)
NetC87_2: C87.2 U13.4(CAP-)
NetC88_1: C88.1 U14.2(CAP+)
NetC88_2: C88.2 U14.4(CAP-)
NetC89_1: C89.1 U15.2(CAP+)
NetC89_2: C89.2 U15.4(CAP-)
NetC90_1: C90.1 U16.2(CAP+)
NetC90_2: C90.2 U16.4(CAP-)
NetC91_1: C91.1 U17.2(CAP+)
NetC91_2: C91.2 U17.4(CAP-)
NetJ4_10: U9.8(~{CS}) ; port MOD_DA_CS
NetJ4_14: R33.1 ; port MOD_DA_CLK
NetJ4_16: R32.1 ; port MOD_DA_SDI
NetJ4_20: R24.2 ; port PI_DA_CS
NetJ4_21: R25.2 ; port PI_DA_SDIO
NetJ4_23: R26.2 ; port PI_DA_SCLK
NetR24_1: R24.1 U8.14(~{CS})
NetR25_1: R25.1 U8.15(SDIO)
NetR26_1: R26.1 U8.16(SCLK)
NetR27_1: R27.1 U8.3(XIN)
NetR28_1: R28.1 R29.1 U7.5(+IN_B)
NetR34_2: R34.2 U10.1(OUTA)
NetR40_2: R40.2 R42.1 U11.7(EN)

Not connected (* = marked no-connect by the designer): U6 1(DNC_1)* 3(NIC_1)* 7(NIC_2)* 8(DNC_2)*; U8 2(XOUT)* 6(DNC_3)* 7(DNC_2)* 8(DNC)*; U13 1(SD)* 7(OSC)*; U14 1(SD)* 7(OSC)*; U15 1(SD)* 7(OSC)*; U16 1(SD)* 7(OSC)*; U17 1(SD)* 7(OSC)*

### Notes on the sheet
- 2PI Control DAC
- MIOC Drive DAC
- Dual Supply
- Labels drawn without touching a wire or pin: +xV

### Library data of the parts
C45 C46 C50-C67 C69-C94 = Cap: Capacitor; Published: 8-Jun-2000; LatestRevisionDate: 17-Jul-2002; LatestRevisionNote: Re-released for DXP Platform.; PackageReference: RAD-0.3; Publisher: Altium Limited; PackageDescription: Radial Cap, Thru-Hole; 2 Leads; 0.3 in Pin Spacing
C47-C49 C68 = Cap Pol1: Polarized Capacitor (Radial); Published: 8-Jun-2000; LatestRevisionDate: 17-Jul-2002; LatestRevisionNote: Re-released for DXP Platform.; PackageReference: RB7.6-15; Publisher: Altium Limited; PackageDescription: Polarized Capacitor (Radial); 2 Leads
D1 D2 = CD1206-S01575: CD1206-S01575, SMT Switching Diode, Vr=75V 150mA, 4ns, 2-Pin 1206 | Bourns CD1206-S01575; SnapEDA_Link: https://www.snapeda.com/parts/CD1206-S01575/Bourns/view-part/?ref=snap; Package: 1206 Bourns; Value: *; MF: Bourns; MP: CD1206-S01575; Check_prices: https://www.snapeda.com/parts/CD1206-S01575/Bourns/view-part/?ref=eda
J1 = 22053031: Headers R/A PCB HDR 3P TIN FRICTION LOCK | Molex Incorporated 22-05-3031; SnapEDA_Link: https://www.snapeda.com/parts/22-05-3031/Molex/view-part/?ref=snap; Package: None; Value: *; MF: Molex; MP: 22-05-3031; Check_prices: https://www.snapeda.com/parts/22-05-3031/Molex/view-part/?ref=eda
L4 L5 = Inductor: Code_IEC: 1005; Published: 8-Jun-2000; LatestRevisionDate: 29-May-2009; LatestRevisionNote: IPC-7351 Footprint Added.; PackageReference: 0402-A; Publisher: Altium Limited; PackageDescription: Chip Inductor; Code_JEITA: 0402
R23-R49 = Res2: Resistor; Published: 8-Jun-2000; LatestRevisionDate: 17-Jul-2002; LatestRevisionNote: Re-released for DXP Platform.; PackageReference: AXIAL-0.4; Publisher: Altium Limited; PackageDescription: Axial Device, Thru-Hole; 2 Leads; 0.4 in Pin Spacing
U6 = ADR441ARZ: as U3 on sheet Analog_Acquisition_Circuit; Manufacturer_Part_Number: ADR441ARZ; Mouser Part Number: 584-ADR441ARZ; Mouser Price/Stock: https://www.mouser.co.uk/ProductDetail/Analog-Devices/ADR441ARZ?qs=WIvQP4zGanjF%252B9HT%2FrItQQ%3D%3D; Arrow Part Number: ADR441ARZ; Arrow Price/Stock: https://www.arrow.com/en/products/adr441arz/analog-devices?region=europe; Datasheet Link: https://www.analog.com/media/en/technical-documentation/data-sheets/adr440_441_443_444_445.pdf
U7 = AD8599ARZ: Ultralow Distortion, Ultralow Noise Op Amp (Dual); MF: Analog Devices; Package: SOIC-8 Analog Devices; Price: None; Check_prices: https://www.snapeda.com/parts/AD8599ARZ/Analog+Devices/view-part/?ref=eda; Value: *; SnapEDA_Link: https://www.snapeda.com/parts/AD8599ARZ/Analog+Devices/view-part/?ref=snap; MP: AD8599ARZ; Availability: In Stock; Purchase-URL: https://pricing.snapeda.com/search?q=AD8599ARZ&ref=eda
U8 = DAC1220E/2K5: Digital-to-Analog Converter; Package: None; Price: None; Value: *; MP: DAC1220E/2K5; Availability: Unavailable
U9 = AD5543BRMZ: AD5543BRMZ, 16-Bit General Purpose DAC 2.47Msps, SPI, 8-Pin MSOP; Manufacturer_Name: Analog Devices; Geometry.Height: 1.1mm; Manufacturer_Part_Number: AD5543BRMZ; Mouser Part Number: 584-AD5543BRMZ; Mouser Price/Stock: https://www.mouser.co.uk/ProductDetail/Analog-Devices/AD5543BRMZ?qs=NmRFExCfTkGF7F9gS5LwsA%3D%3D; Arrow Part Number: AD5543BRMZ; Arrow Price/Stock: https://www.arrow.com/en/products/ad5543brmz/analog-devices?utm_currency=USD&region=nac; Datasheet Link: http://www.analog.com/static/imported-files/data_sheets/AD5543_5553.pdf
U10 = OPA2140AID: Dual-channel, 11-MHz, low-noise 36-V JFET precision operational amplifier with rail-to-rail output; MF: Texas Instruments; SnapEDA_Link: https://www.snapeda.com/parts/OPA2140AID/Texas+Instruments/view-part/?ref=snap; Package: SOIC-8 Texas Instruments; Value: *; MP: OPA2140AID; Check_prices: https://www.snapeda.com/parts/OPA2140AID/Texas+Instruments/view-part/?ref=eda
U11 = LMP8350MA_NOPB: Ultra Low Distortion Fully Differential Precision ADC Driver with Selectable Power Modes; Manufacturer_Name: Texas Instruments; Manufacturer_Part_Number: LMP8350MA/NOPB; Geometry.Height: 1.75mm; Mouser Part Number: 926-LMP8350MA/NOPB; Mouser Price/Stock: https://www.mouser.co.uk/ProductDetail/Texas-Instruments/LMP8350MA-NOPB?qs=OYMYEaN9QmBOQoVkyNgTKw%3D%3D; Arrow Part Number: LMP8350MA/NOPB; Arrow Price/Stock: null?region=nac; Datasheet Link: http://www.ti.com/lit/gpn/lmp8350
U12 = LP2985AIM5-3.0: 150-mA, 16-V, low-dropout voltage regulator with enable; MF: Texas Instruments; MP: LP2985AIM5-3.0/NOPB; SnapEDA_Link: https://www.snapeda.com/parts/LP2985AIM5-3.0/NOPB/Texas+Instruments/view-part/?ref=snap; Package: SOT-23-5 Texas Instruments; Value: *; Check_prices: https://www.snapeda.com/parts/LP2985AIM5-3.0/NOPB/Texas+Instruments/view-part/?ref=eda
U13-U17 = LM2663M_NOPB: 200mA switched capacitor voltage converter with low current shutdown mode; Manufacturer_Name: Texas Instruments; Manufacturer_Part_Number: LM2663M/NOPB; Geometry.Height: 1.75mm; Mouser Part Number: 926-LM2663M/NOPB; Mouser Price/Stock: https://www.mouser.co.uk/ProductDetail/Texas-Instruments/LM2663M-NOPB?qs=X1J7HmVL2ZH655akkcil2g%3D%3D; Arrow Part Number: LM2663M/NOPB; Arrow Price/Stock: https://www.arrow.com/en/products/lm2663mnopb/texas-instruments?utm_currency=USD&region=europe; Datasheet Link: http://www.ti.com/lit/ds/symlink/lm2663.pdf

## Sheet Digital_STMG447RET6.SchDoc
size A3; SheetNumber: 3; SheetTotal: 4
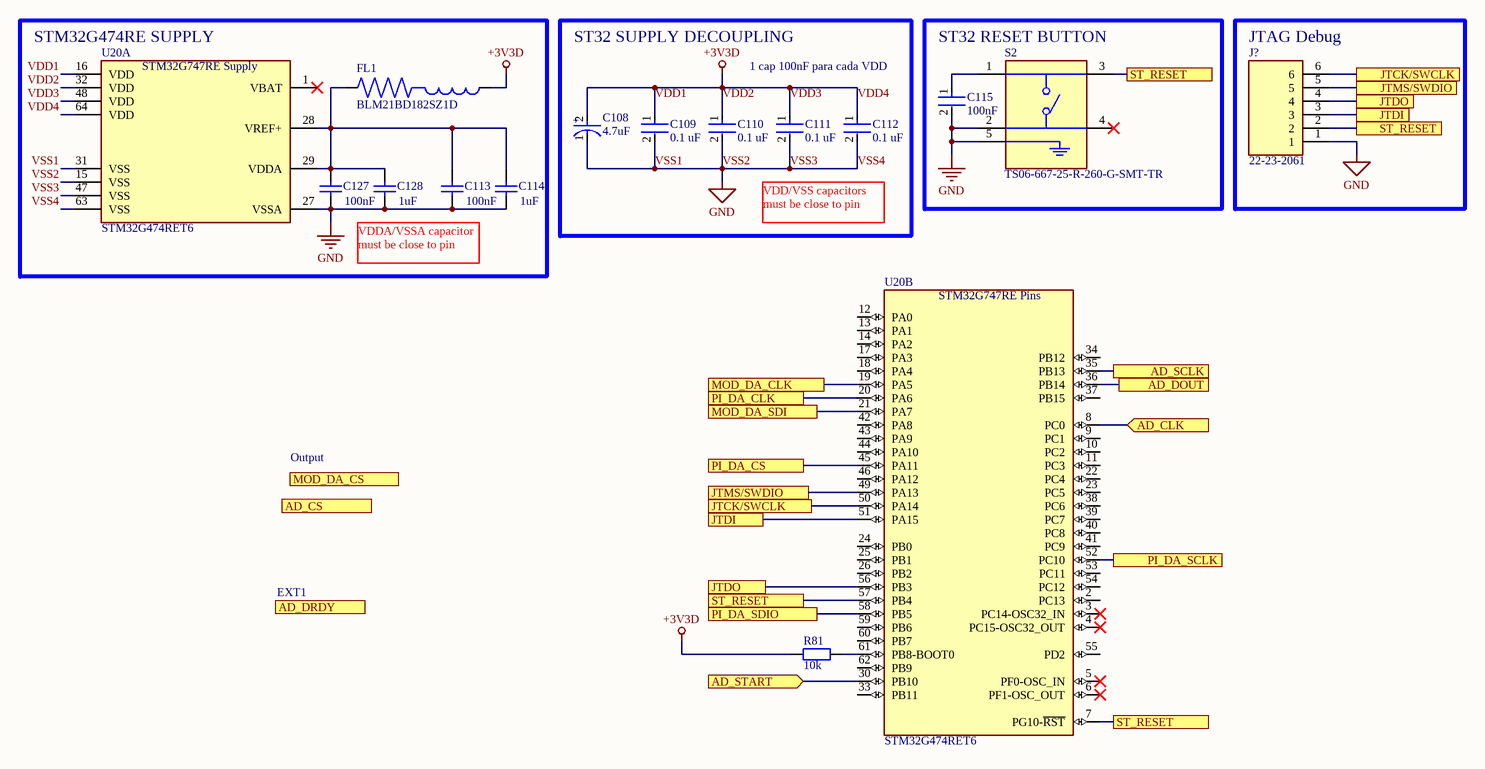
[diagram p2: Digital_STMG447RET6.SchDoc]

### Parts
C108  4.7uF  [FP-TAJR-MFG]
C109  0.1 uF  [FP-CC0805-0_85-MFG]
C110  0.1 uF  [FP-CC0805-0_85-MFG]
C111  0.1 uF  [FP-CC0805-0_85-MFG]
C112  0.1 uF  [FP-CC0805-0_85-MFG]
C113  value 100nF  [RAD-0.3]  (hidden comment: Cap)
C114  value 1uF  [RAD-0.3]  (hidden comment: Cap)
C115  100nF  [FP-CC0805-0_85-MFG]
C127  value 100nF  [RAD-0.3]  (hidden comment: Cap)
C128  value 1uF  [RAD-0.3]  (hidden comment: Cap)
FL1  BLM21BD182SZ1D  [BLM21BD182SZ1D]
J?  22-23-2061  [22-23-2061]
R81  value 10k  [AXIAL-0.4]  (hidden comment: Res2)
S2  TS06-667-25-R-260-G-SMT-TR  [TS06-667-25-R-260-G-SMT-TR]
U20  STM32G474RET6  [STMG474RET6]  (parts A,B of 2)

### Blocks framed on the sheet
STM32G474RE SUPPLY: C113 C114 C127 C128 FL1 U20
ST32 SUPPLY DECOUPLING: C108-C112
ST32 RESET BUTTON: C115 S2
JTAG Debug: J?

### Ports
AD_CLK (in, see Analog_Acquisition_Circuit[5C], Digital_Supply_and_Connectors[2A], Digital_Supply_and_Connectors[4A]), AD_CS (in, see Analog_Acquisition_Circuit[3C], Digital_Supply_and_Connectors[1A], Digital_Supply_and_Connectors[4A]), AD_DOUT (see Analog_Acquisition_Circuit[4C], Digital_Supply_and_Connectors[1A]), AD_DRDY (out, see Analog_Acquisition_Circuit[4C], Digital_Supply_and_Connectors[1A]), AD_SCLK (see Analog_Acquisition_Circuit[5C], Digital_Supply_and_Connectors[1A], Digital_Supply_and_Connectors[4A]), AD_START (in, see Analog_Acquisition_Circuit[3C], Digital_Supply_and_Connectors[1A], Digital_Supply_and_Connectors[4A]), JTCK/SWCLK (see Digital_STMG447RET6[3B]), JTCK/SWCLK (see Digital_STMG447RET6[6A]), JTDI (see Digital_STMG447RET6[3B]), JTDI (see Digital_STMG447RET6[6A]), JTDO (see Digital_STMG447RET6[3B]), JTDO (see Digital_STMG447RET6[6A]), JTMS/SWDIO (see Digital_STMG447RET6[3B]), JTMS/SWDIO (see Digital_STMG447RET6[6A]), MOD_DA_CLK (see Analog_Modulation_and_Supply[5A], Digital_Supply_and_Connectors[1B]), MOD_DA_CS (see Analog_Modulation_and_Supply[5A], Digital_Supply_and_Connectors[1B], Digital_Supply_and_Connectors[3B]), MOD_DA_SDI (see Analog_Modulation_and_Supply[5A], Digital_Supply_and_Connectors[1B]), PI_DA_CLK (see Analog_Modulation_and_Supply[1A], Digital_Supply_and_Connectors[1B], Digital_Supply_and_Connectors[3B]), PI_DA_CS (see Analog_Modulation_and_Supply[1A], Digital_Supply_and_Connectors[1B], Digital_Supply_and_Connectors[3B]), PI_DA_SCLK (see Analog_Modulation_and_Supply[1A], Digital_Supply_and_Connectors[2B], Digital_Supply_and_Connectors[4B]), PI_DA_SDIO (see Analog_Modulation_and_Supply[1A], Digital_Supply_and_Connectors[2B], Digital_Supply_and_Connectors[4B]), ST_RESET (see Digital_STMG447RET6[3B], Digital_STMG447RET6[5A], Digital_STMG447RET6[5B]), ST_RESET (see Digital_STMG447RET6[3B], Digital_STMG447RET6[5A], Digital_STMG447RET6[6A]), ST_RESET (see Digital_STMG447RET6[3B], Digital_STMG447RET6[5B], Digital_STMG447RET6[6A]), ST_RESET (see Digital_STMG447RET6[5A], Digital_STMG447RET6[5B], Digital_STMG447RET6[6A])

### Nets
GND: C108.1(C) C109.2 C110.2 C111.2 C112.2 C113.1 C114.1 C115.2 C127.1 C128.1 J?.1 S2.2 S2.5 U20.15(VSS) U20.27(VSSA) U20.31(VSS) U20.47(VSS) U20.63(VSS)  [also labelled VSS1, VSS2, VSS3, VSS4]
VDD1: C108.2(A) C109.1 C110.1 C111.1 C112.1 FL1.1 R81.1 U20.16(VDD) U20.32(VDD) U20.48(VDD) U20.64(VDD)  [also labelled +3V3D, VDD2, VDD3, VDD4]
NetC57_1: U20.20(PA6) ; port PI_DA_CLK
NetC113_2: C113.2 C114.2 C127.2 C128.2 FL1.2 U20.28(VREF+) U20.29(VDDA)
NetC115_1: C115.1 S2.1
NetJ4_14: U20.19(PA5) ; port MOD_DA_CLK
NetJ4_16: U20.21(PA7) ; port MOD_DA_SDI
NetJ4_20: U20.45(PA11) ; port PI_DA_CS
NetJ4_21: U20.58(PB5) ; port PI_DA_SDIO
NetJ4_23: U20.52(PC10) ; port PI_DA_SCLK
NetJ4_56: U20.30(PB10) ; port AD_START
NetJ4_60: U20.35(PB13) ; port AD_SCLK
NetJ4_62: U20.36(PB14) ; port AD_DOUT
NetJ4_63: U20.8(PC0) ; port AD_CLK
NetJ?_2: J?.2 S2.3 U20.7(PG10-~{RST}) U20.57(PB4) ; port ST_RESET
NetJ?_3: J?.3 U20.51(PA15) ; port JTDI
NetJ?_4: J?.4 U20.56(PB3) ; port JTDO
NetJ?_5: J?.5 U20.49(PA13) ; port JTMS/SWDIO
NetJ?_6: J?.6 U20.50(PA14) ; port JTCK/SWCLK
NetR81_2: R81.2 U20.61(PB8-BOOT0)

Not connected (* = marked no-connect by the designer): S2 4*; U20 1(VBAT)* 2(PC13) 3(PC14-OSC32_IN)* 4(PC15-OSC32_OUT)* 5(PF0-OSC_IN)* 6(PF1-OSC_OUT)* 9(PC1) 10(PC2) 11(PC3) 12(PA0) 13(PA1) 14(PA2) 17(PA3) 18(PA4) 22(PC4) 23(PC5) 24(PB0) 25(PB1) 26(PB2) 33(PB11) 34(PB12) 37(PB15) 38(PC6) 39(PC7) 40(PC8) 41(PC9) 42(PA8) 43(PA9) 44(PA10) 46(PA12) 53(PC11) 54(PC12) 55(PD2) 59(PB6) 60(PB7) 62(PB9)

### Notes on the sheet
- 1 cap 100nF para cada VDD
- VDD/VSS capacitors must be close to pin
- VDDA/VSSA capacitor must be close to pin
- Output
- EXT1
- (in symbol CMP-2007-04030-2) +
- (in symbol STM32G474RET6, part A) STM32G747RE Supply
- (in symbol STM32G474RET6, part B) STM32G747RE Pins

### Library data of the parts
C108 = CMP-2007-04030-2: 4.7uF 10V  ±10% 9Ω 0805  SMD Tantalum Capacitor; Dissipation Factor: 6%; ESR (Equivalent Series Resistance): 9R; Leakage Current: 500nA; Polarity: Polar; Lead Free: Lead Free; Min Operating Temperature: -55°C; Width: 1.3mm; Depth: 1.3mm; Case Code (Metric): 2012; Features: General Purpose; Length: 2.05mm; Package Quantity: 1; Tolerance: 10%; Height - Seated (Max): 0.047inch; REACH SVHC: No SVHC; Termination: SMD/SMT; Max Operating Temperature: 125°C; Mount: Surface Mount; Case/Package: 0805; Packaging: Tape and Reel; Case Code (Imperial): 0805; Voltage: 10V; Dielectric Material: Tantalum; Weight: 0.000194oz; Construction: Flat; Series: TAJ; Radiation Hardening: No; Voltage Rating: 10V; Height: 1.2mm; Capacitance: 4.7uF; RoHS Compliant: Yes
C109-C112 = CMP-1036-04410-2: CAP CER 0.1UF 25V X7R 0805; Manufacturer Part Number: CC0805KRX7R8BB104; Manufacturer: Yageo; Tolerance: 0.1; Material: Ceramic; Value: 100 nF; ComponentLink2URL: http://www.yageo.com/documents/recent/UPY-GPHC_Y5V_6.3V-to-50V_8.pdf; Category: Cap; Mouser Description: Multilayer Ceramic Capacitors MLCC - SMD/SMT 100nF 25V X7R 10%; Device Class L1: Passive Components; Footprint Url: http://www.yageo.com/exep/pages/download/literatures/UPY-C_GEN_24.pdf; Height: 0.95mm; Digikey Description: CAP CER 0.1UF 25V X7R 0805; Lead Free: Yes; Temperature Range High: +85°C; Temperature: -30°C to +85°C; Ipc Land Pattern Name: CAPC200125X85; Capacitance: 100 nF; Automotive: No; Octopart: https://octopart.com/cc0805krx7r8bb104-yageo-39467766; Device Class L2: Capacitors; Temperature Characteristic: X7R; Voltage Rating: 25 V; ComponentLink2Description: Datasheet; Temperature Range Low: -30°C; Device Class L3: Ceramic Capacitors; RoHS: TRUE; Package: CC0805-0.85
C113 C114 C127 C128 = Cap: Capacitor; Published: 8-Jun-2000; LatestRevisionDate: 17-Jul-2002; LatestRevisionNote: Re-released for DXP Platform.; PackageReference: RAD-0.3; Publisher: Altium Limited; PackageDescription: Radial Cap, Thru-Hole; 2 Leads; 0.3 in Pin Spacing
C115 = CMP-1036-04410-2: CAP CER 0.1UF 25V X7R 0805; Manufacturer Part Number: CC0805KRX7R8BB104; Manufacturer: Yageo; Tolerance: 0.1; Material: Ceramic; ComponentLink2URL: http://www.yageo.com/documents/recent/UPY-GPHC_Y5V_6.3V-to-50V_8.pdf; Category: Cap; Mouser Description: Multilayer Ceramic Capacitors MLCC - SMD/SMT 100nF 25V X7R 10%; Device Class L1: Passive Components; Footprint Url: http://www.yageo.com/exep/pages/download/literatures/UPY-C_GEN_24.pdf; Height: 0.95mm; Digikey Description: CAP CER 0.1UF 25V X7R 0805; Lead Free: Yes; Temperature Range High: +85°C; Temperature: -30°C to +85°C; Ipc Land Pattern Name: CAPC200125X85; Value: 100 nF; Capacitance: 100 nF; Automotive: No; Octopart: https://octopart.com/cc0805krx7r8bb104-yageo-39467766; Device Class L2: Capacitors; Temperature Characteristic: X7R; Voltage Rating: 25 V; ComponentLink2Description: Datasheet; Temperature Range Low: -30°C; Device Class L3: Ceramic Capacitors; RoHS: TRUE; Package: CC0805-0.85
J? = 22-23-2061: 2.54mm,header,KK,vert,Sn,frictn lock,6w Molex KK 254 Series, Series Number 6373, 2.54mm Pitch 6 Way 1 Row Straight PCB Header, Through Hole, Solder Termination; Geometry.Height: 11.05mm; Manufacturer_Name: Molex; Manufacturer_Part_Number: 22-23-2061; Mouser Part Number: 538-22-23-2061; Mouser Price/Stock: https://www.mouser.co.uk/ProductDetail/Molex/22-23-2061?qs=ILqg114nvd6YkpLBwrcQsQ%3D%3D; Arrow Part Number: *; Arrow Price/Stock: *; Datasheet Link: http://www.molex.com/pdm_docs/sd/022232061_sd.pdf
R81 = Res2: Resistor; Published: 8-Jun-2000; LatestRevisionDate: 17-Jul-2002; LatestRevisionNote: Re-released for DXP Platform.; PackageReference: AXIAL-0.4; Publisher: Altium Limited; PackageDescription: Axial Device, Thru-Hole; 2 Leads; 0.4 in Pin Spacing
S2 = TS06-667-25-R-260-G-SMT-TR: 6 x 6.7 mm, 2.5 mm Actuator Height, 260 gf, Red, Surface Mount, SPST, Tactile Switch; MF: Same Sky; SnapEDA_Link: https://www.snapeda.com/parts/TS06-667-25-R-260-G-SMT-TR/Same+Sky/view-part/?ref=snap; Package: None; Value: *; MP: TS06-667-25-R-260-G-SMT-TR; Check_prices: https://www.snapeda.com/parts/TS06-667-25-R-260-G-SMT-TR/Same+Sky/view-part/?ref=eda
U20 = STM32G474RET6: ARMÂ® CortexÂ®-M4F STM32G4 Microcontroller IC 32-Bit Single-Core 170MHz 512KB (512K x 8) FLASH 64-LQFP (10x10); MF: STMicroelectronics; SnapEDA_Link: https://www.snapeda.com/parts/STM32G474RET6/STMicroelectronics/view-part/?ref=snap; Package: LQFP-64 STMicroelectronics; Value: *; MP: STM32G474RET6; Check_prices: https://www.snapeda.com/parts/STM32G474RET6/STMicroelectronics/view-part/?ref=eda
FL1 = BLM21BD182SZ1D: Package: None; Price: None; Value: *; MP: BLM21BD182SZ1D; Availability: Unavailable